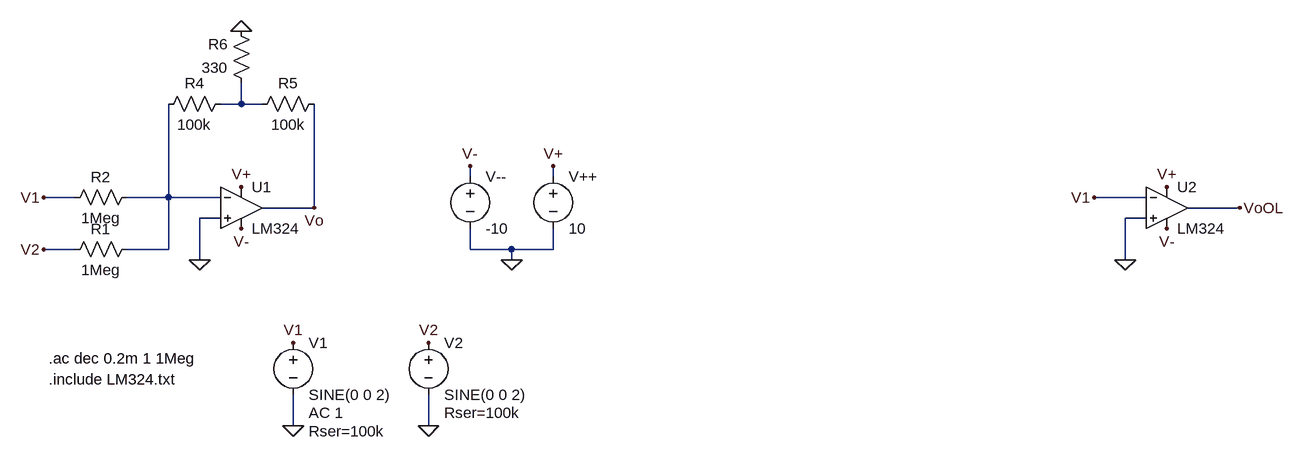
[diagram p0: schematic Lab2Circ1_2.asc]
Lab2Circ1_2.asc, the LTspice schematic file:
Version 4
SHEET 1 1820 680
WIRE 208 0 208 -32
WIRE 208 0 176 0
WIRE 240 0 208 0
WIRE 560 112 560 96
WIRE 688 112 688 96
WIRE -48 144 -96 144
WIRE 96 144 96 0
WIRE 96 144 32 144
WIRE 176 144 96 144
WIRE 1600 144 1520 144
WIRE 320 160 320 0
WIRE 320 160 240 160
WIRE 1744 160 1664 160
WIRE 176 176 144 176
WIRE 1600 176 1568 176
WIRE -48 224 -96 224
WIRE 96 224 96 144
WIRE 96 224 32 224
WIRE 560 224 560 192
WIRE 624 224 560 224
WIRE 688 224 688 192
WIRE 688 224 624 224
WIRE 144 240 144 176
WIRE 624 240 624 224
WIRE 1568 240 1568 176
WIRE 288 496 288 448
WIRE 496 496 496 448
FLAG 624 240 0
FLAG 688 96 V+
FLAG 208 128 V+
FLAG 560 96 V-
FLAG 208 192 V-
FLAG 288 496 0
FLAG 496 496 0
FLAG 288 368 V1
FLAG 496 368 V2
FLAG 320 160 Vo
FLAG 144 240 0
FLAG -96 144 V1
FLAG 1632 128 V+
FLAG 1632 192 V-
FLAG 1744 160 VoOL
FLAG 1568 240 0
FLAG 1520 144 V1
FLAG 208 -112 0
FLAG -96 224 V2
SYMBOL AutoGenerated\\LM324 208 96 R0
SYMATTR InstName U1
SYMBOL voltage 688 96 R0
WINDOW 123 0 0 Left 0
WINDOW 39 24 124 Left 2
SYMATTR InstName V++
SYMATTR Value 10
SYMBOL voltage 560 96 R0
WINDOW 123 0 0 Left 0
WINDOW 39 24 124 Left 2
SYMATTR InstName V--
SYMATTR Value -10
SYMBOL res 48 128 R90
WINDOW 0 0 56 VBottom 2
WINDOW 3 32 56 VTop 2
SYMATTR InstName R2
SYMATTR Value 1Meg
SYMBOL voltage 288 352 R0
WINDOW 123 24 124 Left 2
WINDOW 39 24 152 Left 2
SYMATTR Value2 AC 1
SYMATTR SpiceLine Rser=100k
SYMATTR InstName V1
SYMATTR Value SINE(0 0 2)
SYMBOL voltage 496 352 R0
WINDOW 123 24 124 Left 2
WINDOW 39 24 124 Left 2
SYMATTR SpiceLine Rser=100k
SYMATTR InstName V2
SYMATTR Value SINE(0 0 2)
SYMBOL res 48 208 R90
WINDOW 0 0 56 VBottom 2
WINDOW 3 32 56 VTop 2
SYMATTR InstName R1
SYMATTR Value 1Meg
SYMBOL AutoGenerated\\LM324 1632 96 R0
SYMATTR InstName U2
SYMBOL res 192 -16 R90
WINDOW 0 0 56 VBottom 2
WINDOW 3 32 56 VTop 2
SYMATTR InstName R4
SYMATTR Value 100k
SYMBOL res 336 -16 R90
WINDOW 0 0 56 VBottom 2
WINDOW 3 32 56 VTop 2
SYMATTR InstName R5
SYMATTR Value 100k
SYMBOL res 224 -16 R180
WINDOW 0 36 76 Left 2
WINDOW 3 36 40 Left 2
SYMATTR InstName R6
SYMATTR Value 330
TEXT -88 424 Left 2 !.include LM324.txt
TEXT -88 392 Left 2 !.ac dec 0.2m 1 1Meg

The netlist it stands for:
* Lab2Circ1_2.asc
* U1: LM324 (symbol AutoGenerated\LM324 not available, pins judged from their places): In+=0 In-=N002 V+=V+ V-=V- OUT=Vo
V++ V+ 0 10
V-- V- 0 -10
R2 N002 V1 1Meg
V1 V1 0 SINE(0 0 2) AC 1 Rser=100k
V2 V2 0 SINE(0 0 2) Rser=100k
R1 N002 V2 1Meg
* U2: LM324 (symbol AutoGenerated\LM324 not available, pins judged from their places): In+=0 In-=V1 V+=V+ V-=V- OUT=VoOL
R4 N001 N002 100k
R5 Vo N001 100k
R6 N001 0 330
.include LM324.txt
.ac dec 0.2m 1 1Meg
.backanno
.end